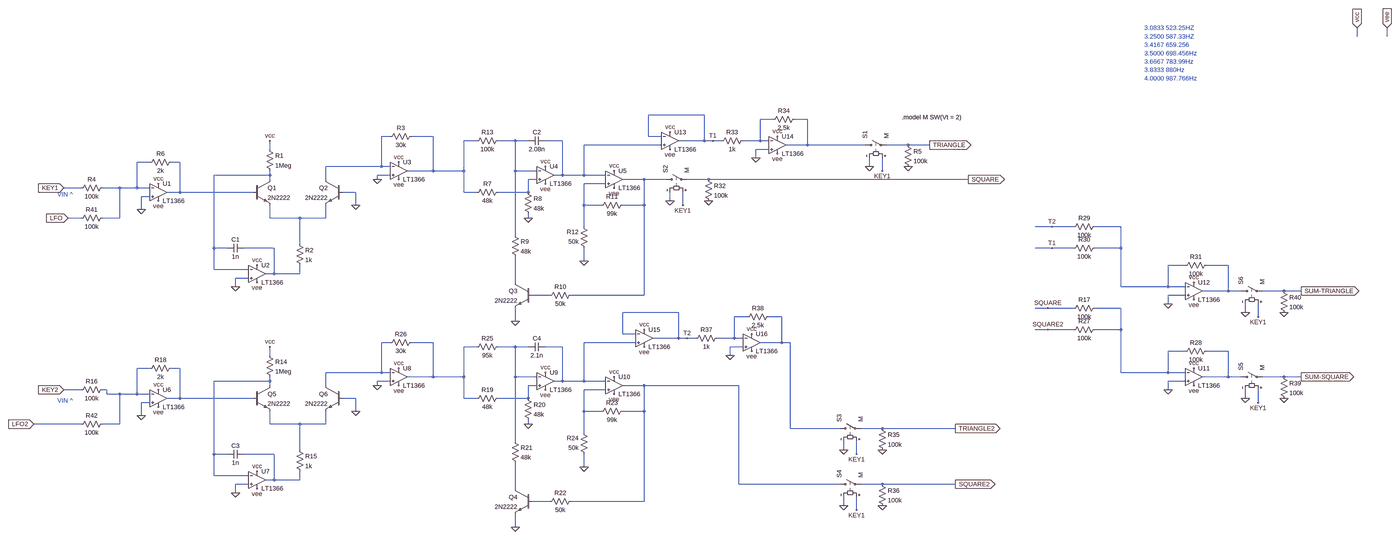
[diagram p0: schematic VCO_FINALFINALs.asc, whole sheet]
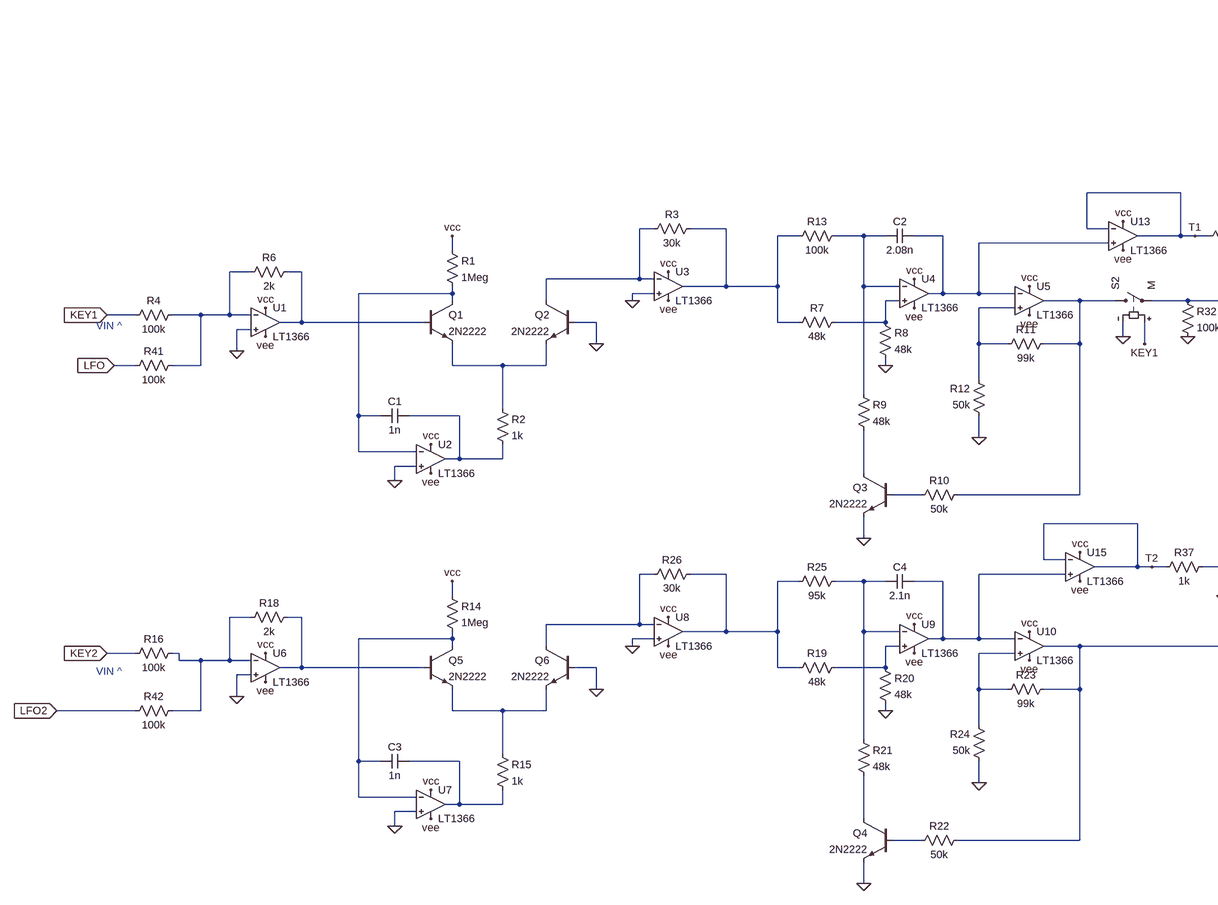
[diagram p1: schematic VCO_FINALFINALs.asc, part, row 1 of 1, column 1 of 2]
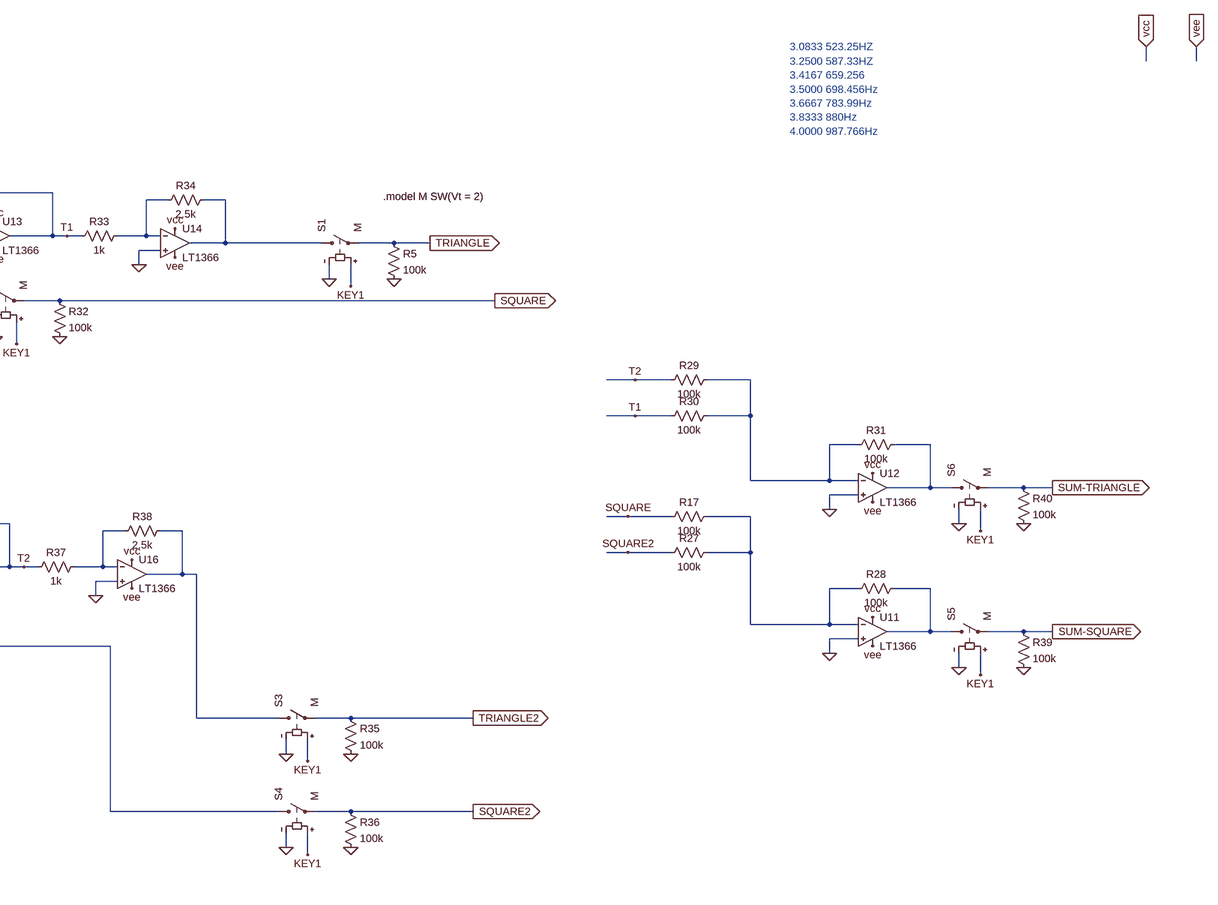
[diagram p2: schematic VCO_FINALFINALs.asc, part, row 1 of 1, column 2 of 2]
VCO_FINALFINALs.asc, the LTspice schematic file:
Version 4
SHEET 1 5164 1992
WIRE 4560 -752 4560 -784
WIRE 4672 -752 4672 -784
WIRE 1952 -256 1744 -256
WIRE 2208 -240 2160 -240
WIRE 2336 -240 2288 -240
WIRE 640 -176 608 -176
WIRE 800 -176 720 -176
WIRE 1744 -176 1744 -256
WIRE 1792 -176 1744 -176
WIRE 1104 -160 1056 -160
WIRE 1248 -160 1184 -160
WIRE 1296 -160 1248 -160
WIRE 1424 -160 1360 -160
WIRE 1952 -160 1952 -256
WIRE 1952 -160 1856 -160
WIRE 1984 -160 1952 -160
WIRE 2016 -160 1984 -160
WIRE 2160 -160 2160 -240
WIRE 2160 -160 2096 -160
WIRE 2192 -160 2160 -160
WIRE 1792 -144 1504 -144
WIRE 2336 -144 2336 -240
WIRE 2336 -144 2256 -144
WIRE 2576 -144 2336 -144
WIRE 2736 -144 2656 -144
WIRE 2816 -144 2736 -144
WIRE 192 -128 192 -160
WIRE 2192 -128 2144 -128
WIRE 2144 -96 2144 -128
WIRE -352 -80 -400 -80
WIRE -240 -80 -272 -80
WIRE 608 -64 608 -176
WIRE 608 -64 400 -64
WIRE 640 -64 608 -64
WIRE 2592 -64 2592 -96
WIRE 800 -48 800 -176
WIRE 800 -48 704 -48
WIRE 1056 -48 1056 -160
WIRE 1056 -48 800 -48
WIRE 1248 -48 1248 -160
WIRE 1328 -48 1248 -48
WIRE 2640 -48 2640 -96
WIRE 192 -32 192 -48
WIRE 192 -32 -16 -32
WIRE 640 -32 592 -32
WIRE 1424 -32 1424 -160
WIRE 1424 -32 1392 -32
WIRE 1504 -32 1504 -144
WIRE 1504 -32 1424 -32
WIRE 1584 -32 1504 -32
WIRE 192 -16 192 -32
WIRE 400 -16 400 -64
WIRE 592 -16 592 -32
WIRE 1328 -16 1296 -16
WIRE 1728 -16 1648 -16
WIRE 1808 -16 1728 -16
WIRE 1968 -16 1888 -16
WIRE 2960 -16 1968 -16
WIRE 1584 0 1504 0
WIRE -608 16 -672 16
WIRE -464 16 -528 16
WIRE -400 16 -400 -80
WIRE -400 16 -464 16
WIRE -352 16 -400 16
WIRE -240 32 -240 -80
WIRE -240 32 -288 32
WIRE 128 32 -240 32
WIRE 512 32 464 32
WIRE 1056 32 1056 -48
WIRE 1104 32 1056 32
WIRE 1296 32 1296 -16
WIRE 1296 32 1184 32
WIRE -352 48 -384 48
WIRE 1824 64 1824 32
WIRE 512 80 512 32
WIRE 1504 80 1504 0
WIRE 1568 80 1504 80
WIRE 1728 80 1728 -16
WIRE 1728 80 1648 80
WIRE 1872 80 1872 32
WIRE -384 96 -384 48
WIRE -608 128 -656 128
WIRE -464 128 -464 16
WIRE -464 128 -528 128
WIRE 192 128 192 80
WIRE 304 128 192 128
WIRE 400 128 400 80
WIRE 400 128 304 128
WIRE 1296 128 1296 112
WIRE 1504 160 1504 80
WIRE 3424 160 3360 160
WIRE 3504 160 3424 160
WIRE 3680 160 3584 160
WIRE 1248 192 1248 -48
WIRE 304 224 304 128
WIRE -16 240 -16 -32
WIRE 32 240 -16 240
WIRE 208 240 96 240
WIRE 3424 240 3360 240
WIRE 3504 240 3424 240
WIRE 3680 240 3680 160
WIRE 3680 240 3584 240
WIRE 1504 288 1504 240
WIRE 3920 304 3856 304
WIRE 4080 304 4000 304
WIRE -16 320 -16 240
WIRE 112 320 -16 320
WIRE 208 336 208 240
WIRE 208 336 176 336
WIRE 304 336 304 304
WIRE 304 336 208 336
WIRE 112 352 64 352
WIRE 1248 368 1248 272
WIRE 64 384 64 352
WIRE 3680 384 3680 240
WIRE 3856 384 3856 304
WIRE 3856 384 3680 384
WIRE 3920 384 3856 384
WIRE 4080 400 4080 304
WIRE 4080 400 3984 400
WIRE 4128 400 4080 400
WIRE 4288 400 4208 400
WIRE 4352 400 4288 400
WIRE 1376 416 1312 416
WIRE 1728 416 1728 80
WIRE 1728 416 1456 416
WIRE 3920 416 3856 416
WIRE 3856 448 3856 416
WIRE 3408 464 3360 464
WIRE 3504 464 3408 464
WIRE 3680 464 3584 464
WIRE 1856 480 1648 480
WIRE 4144 480 4144 448
WIRE 2112 496 2064 496
WIRE 2240 496 2192 496
WIRE 4192 496 4192 448
WIRE 1248 512 1248 464
WIRE 3408 544 3360 544
WIRE 3504 544 3408 544
WIRE 3680 544 3680 464
WIRE 3680 544 3584 544
WIRE 1648 560 1648 480
WIRE 1696 560 1648 560
WIRE 1856 576 1856 480
WIRE 1856 576 1760 576
WIRE 1888 576 1856 576
WIRE 1920 576 1888 576
WIRE 2064 576 2064 496
WIRE 2064 576 2000 576
WIRE 2096 576 2064 576
WIRE 640 592 608 592
WIRE 800 592 720 592
WIRE 1696 592 1504 592
WIRE 2240 592 2240 496
WIRE 2240 592 2160 592
WIRE 2272 592 2240 592
WIRE 1104 608 1056 608
WIRE 1248 608 1184 608
WIRE 1296 608 1248 608
WIRE 1424 608 1360 608
WIRE 2096 608 2048 608
WIRE 3920 624 3856 624
WIRE 4080 624 4000 624
WIRE 192 640 192 608
WIRE 2048 640 2048 608
WIRE -352 688 -400 688
WIRE -240 688 -272 688
WIRE 608 704 608 592
WIRE 608 704 400 704
WIRE 640 704 608 704
WIRE 3680 704 3680 544
WIRE 3856 704 3856 624
WIRE 3856 704 3680 704
WIRE 3920 704 3856 704
WIRE 800 720 800 592
WIRE 800 720 704 720
WIRE 1056 720 1056 608
WIRE 1056 720 800 720
WIRE 1248 720 1248 608
WIRE 1328 720 1248 720
WIRE 4080 720 4080 624
WIRE 4080 720 3984 720
WIRE 4128 720 4080 720
WIRE 4288 720 4208 720
WIRE 4352 720 4288 720
WIRE 192 736 192 720
WIRE 192 736 -16 736
WIRE 640 736 592 736
WIRE 1424 736 1424 608
WIRE 1424 736 1392 736
WIRE 1504 736 1504 592
WIRE 1504 736 1424 736
WIRE 1584 736 1504 736
WIRE 3920 736 3856 736
WIRE 192 752 192 736
WIRE 400 752 400 704
WIRE 592 752 592 736
WIRE 1328 752 1296 752
WIRE 1728 752 1648 752
WIRE 2080 752 1728 752
WIRE -608 768 -672 768
WIRE -512 768 -528 768
WIRE 1584 768 1504 768
WIRE 3856 768 3856 736
WIRE -512 784 -512 768
WIRE -464 784 -512 784
WIRE -400 784 -400 688
WIRE -400 784 -464 784
WIRE -352 784 -400 784
WIRE -240 800 -240 688
WIRE -240 800 -288 800
WIRE 128 800 -240 800
WIRE 512 800 464 800
WIRE 1056 800 1056 720
WIRE 1104 800 1056 800
WIRE 1296 800 1296 752
WIRE 1296 800 1184 800
WIRE 4144 800 4144 768
WIRE -352 816 -384 816
WIRE 4192 816 4192 768
WIRE 512 848 512 800
WIRE 1504 848 1504 768
WIRE 1568 848 1504 848
WIRE 1728 848 1728 752
WIRE 1728 848 1648 848
WIRE -384 864 -384 816
WIRE -608 896 -784 896
WIRE -464 896 -464 784
WIRE -464 896 -528 896
WIRE 192 896 192 848
WIRE 304 896 192 896
WIRE 400 896 400 848
WIRE 400 896 304 896
WIRE 1296 896 1296 880
WIRE 2272 912 2272 592
WIRE 2480 912 2272 912
WIRE 2640 912 2560 912
WIRE 2912 912 2640 912
WIRE 1504 928 1504 848
WIRE 1248 960 1248 720
WIRE 304 992 304 896
WIRE 2496 992 2496 960
WIRE -16 1008 -16 736
WIRE 32 1008 -16 1008
WIRE 208 1008 96 1008
WIRE 2544 1008 2544 960
WIRE 1504 1056 1504 1008
WIRE -16 1088 -16 1008
WIRE 112 1088 -16 1088
WIRE 208 1104 208 1008
WIRE 208 1104 176 1104
WIRE 304 1104 304 1072
WIRE 304 1104 208 1104
WIRE 112 1120 64 1120
WIRE 2080 1120 2080 752
WIRE 2480 1120 2080 1120
WIRE 2640 1120 2560 1120
WIRE 2912 1120 2640 1120
WIRE 1248 1136 1248 1040
WIRE 64 1152 64 1120
WIRE 1376 1184 1312 1184
WIRE 1728 1184 1728 848
WIRE 1728 1184 1456 1184
WIRE 2496 1200 2496 1168
WIRE 2544 1216 2544 1168
WIRE 1248 1280 1248 1232
FLAG 512 80 0
FLAG 192 -160 vcc
FLAG 64 384 0
FLAG 592 -16 0
FLAG 672 -80 vcc
FLAG 4560 -784 vcc
IOPIN 4560 -784 In
FLAG 4672 -784 vee
IOPIN 4672 -784 In
FLAG 672 -16 vee
FLAG 144 304 vcc
FLAG 144 368 vee
FLAG -320 0 vcc
FLAG -384 96 0
FLAG -672 16 KEY1
IOPIN -672 16 In
FLAG 1360 -64 vcc
FLAG 1616 -48 vcc
FLAG 2816 -144 TRIANGLE
IOPIN 2816 -144 Out
FLAG 1296 128 0
FLAG 1248 512 0
FLAG 1504 288 0
FLAG 1616 16 vee
FLAG 1360 0 vee
FLAG -320 64 vee
FLAG 512 848 0
FLAG 192 608 vcc
FLAG 64 1152 0
FLAG 592 752 0
FLAG 672 688 vcc
FLAG 672 752 vee
FLAG 144 1072 vcc
FLAG 144 1136 vee
FLAG -320 768 vcc
FLAG -384 864 0
FLAG -672 768 KEY2
IOPIN -672 768 In
FLAG 1360 704 vcc
FLAG 1616 720 vcc
FLAG 2912 912 TRIANGLE2
IOPIN 2912 912 Out
FLAG 1296 896 0
FLAG 1248 1280 0
FLAG 1504 1056 0
FLAG 1616 784 vee
FLAG 1360 768 vee
FLAG -320 832 vee
FLAG 3856 768 0
FLAG 3952 688 vcc
FLAG 3952 752 vee
FLAG 4352 720 SUM-SQUARE
IOPIN 4352 720 Out
FLAG 3856 448 0
FLAG 3952 368 vcc
FLAG 3952 432 vee
FLAG 2960 -16 SQUARE
IOPIN 2960 -16 Out
FLAG 2912 1120 SQUARE2
IOPIN 2912 1120 Out
FLAG 1824 -192 vcc
FLAG 1824 -128 vee
FLAG 2144 -96 0
FLAG 2224 -176 vcc
FLAG 2224 -112 vee
FLAG 3424 240 T1
FLAG 2640 -48 KEY1
FLAG 2592 -64 0
FLAG 2736 -64 0
FLAG 1872 80 KEY1
FLAG 1824 64 0
FLAG 1968 64 0
FLAG 2544 1008 KEY1
FLAG 2496 992 0
FLAG 2640 992 0
FLAG 2544 1216 KEY1
FLAG 2496 1200 0
FLAG 2640 1200 0
FLAG 1728 544 vcc
FLAG 1728 608 vee
FLAG 2048 640 0
FLAG 2128 560 vcc
FLAG 2128 624 vee
FLAG 1984 -160 T1
FLAG 1888 576 T2
FLAG 3424 160 T2
FLAG 4192 816 KEY1
FLAG 4144 800 0
FLAG 4288 800 0
FLAG 4352 400 SUM-TRIANGLE
IOPIN 4352 400 Out
FLAG 4192 496 KEY1
FLAG 4144 480 0
FLAG 4288 480 0
FLAG 3408 544 SQUARE2
FLAG 3408 464 SQUARE
FLAG -656 128 LFO
IOPIN -656 128 In
FLAG -784 896 LFO2
IOPIN -784 896 In
SYMBOL res 176 -144 R0
SYMATTR InstName R1
SYMATTR Value 1Meg
SYMBOL cap 96 224 R90
WINDOW 0 0 32 VBottom 2
WINDOW 3 32 32 VTop 2
SYMATTR InstName C1
SYMATTR Value 1n
SYMBOL res 288 208 R0
SYMATTR InstName R2
SYMATTR Value 1k
SYMBOL res 736 -192 R90
WINDOW 0 0 56 VBottom 2
WINDOW 3 32 56 VTop 2
SYMATTR InstName R3
SYMATTR Value 30k
SYMBOL res -512 0 R90
WINDOW 0 0 56 VBottom 2
WINDOW 3 32 56 VTop 2
SYMATTR InstName R4
SYMATTR Value 100k
SYMBOL res -256 -96 R90
WINDOW 0 0 56 VBottom 2
WINDOW 3 32 56 VTop 2
SYMATTR InstName R6
SYMATTR Value 2k
SYMBOL cap 1360 -176 R90
WINDOW 0 0 32 VBottom 2
WINDOW 3 32 32 VTop 2
SYMATTR InstName C2
SYMATTR Value 2.08n
SYMBOL res 1200 16 R90
WINDOW 0 0 56 VBottom 2
WINDOW 3 32 56 VTop 2
SYMATTR InstName R7
SYMATTR Value 48k
SYMBOL res 1280 16 R0
SYMATTR InstName R8
SYMATTR Value 48k
SYMBOL res 1232 176 R0
SYMATTR InstName R9
SYMATTR Value 48k
SYMBOL npn 1312 368 M0
SYMATTR InstName Q3
SYMATTR Value 2N2222
SYMBOL res 1472 400 R90
WINDOW 0 0 56 VBottom 2
WINDOW 3 32 56 VTop 2
SYMATTR InstName R10
SYMATTR Value 50k
SYMBOL res 1664 64 R90
WINDOW 0 0 56 VBottom 2
WINDOW 3 32 56 VTop 2
SYMATTR InstName R11
SYMATTR Value 99k
SYMBOL res 1520 256 R180
WINDOW 0 36 76 Left 2
WINDOW 3 36 40 Left 2
SYMATTR InstName R12
SYMATTR Value 50k
SYMBOL res 1200 -176 R90
WINDOW 0 0 56 VBottom 2
WINDOW 3 32 56 VTop 2
SYMATTR InstName R13
SYMATTR Value 100k
SYMBOL npn 128 -16 R0
SYMATTR InstName Q1
SYMATTR Value 2N2222
SYMBOL npn 464 -16 M0
SYMATTR InstName Q2
SYMATTR Value 2N2222
SYMBOL LT1366 -320 -32 R0
SYMATTR InstName U1
SYMBOL LT1366 144 272 R0
SYMATTR InstName U2
SYMBOL LT1366 672 -112 R0
SYMATTR InstName U3
SYMBOL LT1366 1360 -96 R0
SYMATTR InstName U4
SYMBOL LT1366 1616 -80 R0
SYMATTR InstName U5
SYMBOL res 176 624 R0
SYMATTR InstName R14
SYMATTR Value 1Meg
SYMBOL cap 96 992 R90
WINDOW 0 0 32 VBottom 2
WINDOW 3 32 32 VTop 2
SYMATTR InstName C3
SYMATTR Value 1n
SYMBOL res 288 976 R0
SYMATTR InstName R15
SYMATTR Value 1k
SYMBOL res -512 752 R90
WINDOW 0 0 56 VBottom 2
WINDOW 3 32 56 VTop 2
SYMATTR InstName R16
SYMATTR Value 100k
SYMBOL res -256 672 R90
WINDOW 0 0 56 VBottom 2
WINDOW 3 32 56 VTop 2
SYMATTR InstName R18
SYMATTR Value 2k
SYMBOL cap 1360 592 R90
WINDOW 0 0 32 VBottom 2
WINDOW 3 32 32 VTop 2
SYMATTR InstName C4
SYMATTR Value 2.1n
SYMBOL res 1200 784 R90
WINDOW 0 0 56 VBottom 2
WINDOW 3 32 56 VTop 2
SYMATTR InstName R19
SYMATTR Value 48k
SYMBOL res 1280 784 R0
SYMATTR InstName R20
SYMATTR Value 48k
SYMBOL res 1232 944 R0
SYMATTR InstName R21
SYMATTR Value 48k
SYMBOL npn 1312 1136 M0
SYMATTR InstName Q4
SYMATTR Value 2N2222
SYMBOL res 1472 1168 R90
WINDOW 0 0 56 VBottom 2
WINDOW 3 32 56 VTop 2
SYMATTR InstName R22
SYMATTR Value 50k
SYMBOL res 1664 832 R90
WINDOW 0 0 56 VBottom 2
WINDOW 3 32 56 VTop 2
SYMATTR InstName R23
SYMATTR Value 99k
SYMBOL res 1520 1024 R180
WINDOW 0 36 76 Left 2
WINDOW 3 36 40 Left 2
SYMATTR InstName R24
SYMATTR Value 50k
SYMBOL res 1200 592 R90
WINDOW 0 0 56 VBottom 2
WINDOW 3 32 56 VTop 2
SYMATTR InstName R25
SYMATTR Value 95k
SYMBOL npn 128 752 R0
SYMATTR InstName Q5
SYMATTR Value 2N2222
SYMBOL npn 464 752 M0
SYMATTR InstName Q6
SYMATTR Value 2N2222
SYMBOL LT1366 -320 736 R0
SYMATTR InstName U6
SYMBOL LT1366 144 1040 R0
SYMATTR InstName U7
SYMBOL LT1366 672 656 R0
SYMATTR InstName U8
SYMBOL LT1366 1360 672 R0
SYMATTR InstName U9
SYMBOL LT1366 1616 688 R0
SYMATTR InstName U10
SYMBOL res 736 576 R90
WINDOW 0 0 56 VBottom 2
WINDOW 3 32 56 VTop 2
SYMATTR InstName R26
SYMATTR Value 30k
SYMBOL LT1366 3952 656 R0
SYMATTR InstName U11
SYMBOL res 3600 448 R90
WINDOW 0 0 56 VBottom 2
WINDOW 3 32 56 VTop 2
SYMATTR InstName R17
SYMATTR Value 100k
SYMBOL res 3600 528 R90
WINDOW 0 0 56 VBottom 2
WINDOW 3 32 56 VTop 2
SYMATTR InstName R27
SYMATTR Value 100k
SYMBOL res 4016 608 R90
WINDOW 0 0 56 VBottom 2
WINDOW 3 32 56 VTop 2
SYMATTR InstName R28
SYMATTR Value 100k
SYMBOL LT1366 3952 336 R0
SYMATTR InstName U12
SYMBOL res 3600 144 R90
WINDOW 0 0 56 VBottom 2
WINDOW 3 32 56 VTop 2
SYMATTR InstName R29
SYMATTR Value 100k
SYMBOL res 3600 224 R90
WINDOW 0 0 56 VBottom 2
WINDOW 3 32 56 VTop 2
SYMATTR InstName R30
SYMATTR Value 100k
SYMBOL res 4016 288 R90
WINDOW 0 0 56 VBottom 2
WINDOW 3 32 56 VTop 2
SYMATTR InstName R31
SYMATTR Value 100k
SYMBOL LT1366 1824 -224 R0
SYMATTR InstName U13
SYMBOL LT1366 2224 -208 R0
SYMATTR InstName U14
SYMBOL res 2112 -176 R90
WINDOW 0 0 56 VBottom 2
WINDOW 3 32 56 VTop 2
SYMATTR InstName R33
SYMATTR Value 1k
SYMBOL res 2304 -256 R90
WINDOW 0 0 56 VBottom 2
WINDOW 3 32 56 VTop 2
SYMATTR InstName R34
SYMATTR Value 2.5k
SYMBOL sw 2560 -144 R270
SYMATTR InstName S1
SYMATTR Value M
SYMBOL res 2720 -160 R0
SYMATTR InstName R5
SYMATTR Value 100k
SYMBOL sw 1792 -16 R270
SYMATTR InstName S2
SYMATTR Value M
SYMBOL res 1952 -32 R0
SYMATTR InstName R32
SYMATTR Value 100k
SYMBOL sw 2464 912 R270
SYMATTR InstName S3
SYMATTR Value M
SYMBOL res 2624 896 R0
SYMATTR InstName R35
SYMATTR Value 100k
SYMBOL sw 2464 1120 R270
SYMATTR InstName S4
SYMATTR Value M
SYMBOL res 2624 1104 R0
SYMATTR InstName R36
SYMATTR Value 100k
SYMBOL LT1366 1728 512 R0
SYMATTR InstName U15
SYMBOL LT1366 2128 528 R0
SYMATTR InstName U16
SYMBOL res 2016 560 R90
WINDOW 0 0 56 VBottom 2
WINDOW 3 32 56 VTop 2
SYMATTR InstName R37
SYMATTR Value 1k
SYMBOL res 2208 480 R90
WINDOW 0 0 56 VBottom 2
WINDOW 3 32 56 VTop 2
SYMATTR InstName R38
SYMATTR Value 2.5k
SYMBOL sw 4112 720 R270
SYMATTR InstName S5
SYMATTR Value M
SYMBOL res 4272 704 R0
SYMATTR InstName R39
SYMATTR Value 100k
SYMBOL sw 4112 400 R270
SYMATTR InstName S6
SYMATTR Value M
SYMBOL res 4272 384 R0
SYMATTR InstName R40
SYMATTR Value 100k
SYMBOL res -512 112 R90
WINDOW 0 0 56 VBottom 2
WINDOW 3 32 56 VTop 2
SYMATTR InstName R41
SYMATTR Value 100k
SYMBOL res -512 880 R90
WINDOW 0 0 56 VBottom 2
WINDOW 3 32 56 VTop 2
SYMATTR InstName R42
SYMATTR Value 100k
TEXT -696 40 Left 2 ;VIN ^
TEXT -696 808 Left 2 ;VIN ^
TEXT 3768 -784 Left 2 ;3.0833 523.25HZ
TEXT 3768 -752 Left 2 ;3.2500 587.33HZ\n3.4167 659.256\n3.5000 698.456Hz\n3.6667 783.99Hz\n3.8333 880Hz\n4.0000 987.766Hz
TEXT 2712 -248 Left 2 !.model M SW(Vt = 2)

The netlist it stands for:
* VCO_FINALFINALs.asc
R1 vcc N009 1Meg
C1 N015 N009 1n
R2 N013 N015 1k
R3 N004 N003 30k
R4 N007 KEY1 100k
R6 N008 N007 2k
C2 N006 N005 2.08n
R7 N010 N004 48k
R8 N010 0 48k
R9 N005 N017 48k
Q3 N017 N018 0 0 2N2222
R10 N011 N018 50k
R11 N011 N012 99k
R12 0 N012 50k
R13 N005 N004 100k
Q1 N009 N008 N013 0 2N2222
Q2 N003 0 N013 0 2N2222
XU1 0 N007 vcc vee N008 LT1366  ; pins In+ In- V+ V- OUT
XU2 0 N009 vcc vee N015 LT1366  ; pins In+ In- V+ V- OUT
XU3 0 N003 vcc vee N004 LT1366  ; pins In+ In- V+ V- OUT
XU4 N010 N005 vcc vee N006 LT1366  ; pins In+ In- V+ V- OUT
XU5 N012 N006 vcc vee N011 LT1366  ; pins In+ In- V+ V- OUT
R14 vcc N029 1Meg
C3 N034 N029 1n
R15 N033 N034 1k
R16 N027 KEY2 100k
R18 N028 N027 2k
C4 N024 N025 2.1n
R19 N030 N023 48k
R20 N030 0 48k
R21 N025 N035 48k
Q4 N035 N036 0 0 2N2222
R22 N031 N036 50k
R23 N031 N032 99k
R24 0 N032 50k
R25 N025 N023 95k
Q5 N029 N028 N033 0 2N2222
Q6 N022 0 N033 0 2N2222
XU6 0 N027 vcc vee N028 LT1366  ; pins In+ In- V+ V- OUT
XU7 0 N029 vcc vee N034 LT1366  ; pins In+ In- V+ V- OUT
XU8 0 N022 vcc vee N023 LT1366  ; pins In+ In- V+ V- OUT
XU9 N030 N025 vcc vee N024 LT1366  ; pins In+ In- V+ V- OUT
XU10 N032 N024 vcc vee N031 LT1366  ; pins In+ In- V+ V- OUT
R26 N023 N022 30k
XU11 0 N019 vcc vee N026 LT1366  ; pins In+ In- V+ V- OUT
R17 N019 SQUARE 100k
R27 N019 SQUARE2 100k
R28 N026 N019 100k
XU12 0 N014 vcc vee N016 LT1366  ; pins In+ In- V+ V- OUT
R29 N014 T2 100k
R30 N014 T1 100k
R31 N016 N014 100k
XU13 N006 T1 vcc vee T1 LT1366  ; pins In+ In- V+ V- OUT
XU14 0 N001 vcc vee N002 LT1366  ; pins In+ In- V+ V- OUT
R33 N001 T1 1k
R34 N002 N001 2.5k
S1 N002 TRIANGLE KEY1 0 M
R5 TRIANGLE 0 100k
S2 N011 SQUARE KEY1 0 M
R32 SQUARE 0 100k
S3 N021 TRIANGLE2 KEY1 0 M
R35 TRIANGLE2 0 100k
S4 N031 SQUARE2 KEY1 0 M
R36 SQUARE2 0 100k
XU15 N024 T2 vcc vee T2 LT1366  ; pins In+ In- V+ V- OUT
XU16 0 N020 vcc vee N021 LT1366  ; pins In+ In- V+ V- OUT
R37 N020 T2 1k
R38 N021 N020 2.5k
S5 N026 SUM-SQUARE KEY1 0 M
R39 SUM-SQUARE 0 100k
S6 N016 SUM-TRIANGLE KEY1 0 M
R40 SUM-TRIANGLE 0 100k
R41 N007 LFO 100k
R42 N027 LFO2 100k
.model NPN NPN
.model PNP PNP
.lib standard.bjt
* VIN ^
* VIN ^
* 3.0833 523.25HZ
* 3.2500 587.33HZ
* 3.4167 659.256
* 3.5000 698.456Hz
* 3.6667 783.99Hz
* 3.8333 880Hz
* 4.0000 987.766Hz
.model M SW(Vt = 2)
.lib LTC.lib
.backanno
.end